# Altium schematic sheet pir_sensor.SchDoc
size A4; SheetNumber: 3; SheetTotal: 3
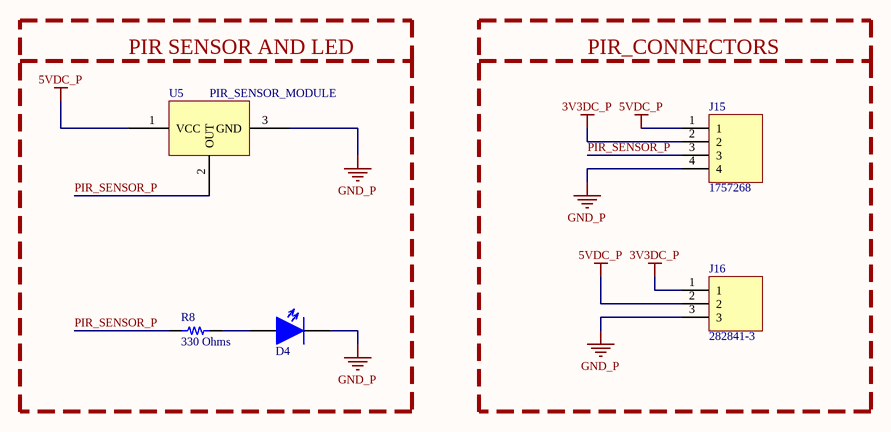
[diagram p0: pir_sensor.SchDoc]

## Parts
D4  LTST-C171GKT  [LED_GREEN_0805]  (value not drawn)
J15  1757268  [CONNECTOR_4Pin]
J16  282841-3  [CONNECTOR_3Pin]
R8  330 Ohms  [RES 0805_2012]
U5  PIR_SENSOR_MODULE  [PIR_SENSOR_MODULE]

## Nets
3V3DC_P: J15.2 J16.1
5VDC_P: J15.1 J16.2 U5.1(VCC)
GND_P: D4.1 J15.4 J16.3 U5.3(GND)
PIR_SENSOR_P: J15.3 R8.1 U5.2(OUT)
NetD4_2: D4.2 R8.2

## Notes on the sheet
- PIR SENSOR AND LED
- PIR_CONNECTORS

## Library data of the parts
D4 = LED GREEN 0805: Green 569nm LED Indication - Discrete 2.1V 0805 (2012 Metric); Manufacturer: Vishay Lite-On; Designed by: EMRE; Lens Color: Colorless; Viewing Angle: 130°; Lens Style: Diffused,Colorless,Rectangular,Clear; Luminous Intensity: 12mcd; Forward Current: 30mA; Power Rating: 100mW; Test Current: 10mA; Lens Transparency: Clear; Number of Elements: 1; Wavelength: 585nm; Reverse Voltage: 5V; Supplier 1: Digi-Key; Manufacturer Part Number: LTST-C171GKT; RoHS: Yes; Category: LEDs; Stock 1: 498344; Pricing 1: 1=0,26000, 10=0,14100, 100=0,06560, 500=0,06060, 1000=0,04747 (USD); Mount: Surface Mount; Case/Package: 0805; Number of Pins: 2; Color: Green; Case Code (Metric): 2012; Case Code (Imperial): 0805; Min Operating Temperature: -55°C; Max Operating Temperature: 85°C; Package Quantity: 1; Packaging: Tape and Reel; Forward Voltage: 2.1V; Illumination Color: Green; Dominant Wavelength: 569nm; Power Dissipation: 100mW; Number of LEDs: 1; Series: CHIPLED 0805; Length: 2mm; Width: 1.25mm; Height: 0.8mm; Depth: 1.25mm; Radiation Hardening: No; Lead Free: Lead Free; RoHS Compliant: Yes; ComponentLink1URL: https://datasheet.ciiva.com/2110/ltst-c171gkt-2110000.pdf?src-supplier=Digi-Key; ComponentLink1Description: https://datasheet.ciiva.com/2110/ltst-c171gkt-2110000.pdf?src-supplier=Digi-Key; ComponentLink2URL: https://datasheet.ciiva.com/11773/0900766b80dc0296-11773991.pdf?src-supplier=RSComponents; ComponentLink2Description: https://datasheet.ciiva.com/11773/0900766b80dc0296-11773991.pdf?src-supplier=RSComponents; ComponentLink3URL: https://datasheet.ciiva.com/12400/lite-on-ltst-c171gkt-190133-12400647.pdf?src-supplier=Mouser; ComponentLink3Description: https://datasheet.ciiva.com/12400/lite-on-ltst-c171gkt-190133-12400647.pdf?src-supplier=Mouser; ComponentLink4URL: https://datasheet.ciiva.com/2110/ltst-c171gkt-2110001.pdf?src-supplier=Digi-Key; ComponentLink4Description: https://datasheet.ciiva.com/2110/ltst-c171gkt-2110001.pdf?src-supplier=Digi-Key; ComponentLink5URL: https://datasheet.ciiva.com/2110/ltst-c171gkt-2110002.pdf?src-supplier=Digi-Key; ComponentLink5Description: https://datasheet.ciiva.com/2110/ltst-c171gkt-2110002.pdf?src-supplier=Digi-Key; ComponentLink6URL: https://datasheet.ciiva.com/16396/ltst-c171gkt-16396549.pdf?src-supplier=Future+Electronics; ComponentLink6Description: https://datasheet.ciiva.com/16396/ltst-c171gkt-16396549.pdf?src-supplier=Future+Electronics; Supplier Part Number 1: 160-1423-1-ND
J15 = CONNECTOR_4Pin: Terminal Header; 12 A; 5.08 mm; 4; Solder Mount; 1.4 mm; 4 kV; 250 V; PBT; Manufacturer: Phoenix Contact; Max Current Rating: 12A; Voltage Rating: 250V; Number of Positions Per Level: 4; Number of Levels: 1; Current: 15A; Voltage: 300V; Gender: Male; Connector Type: Plug; Pitch: 5.08mm; Approvals: UL,CSA; Supplier 1: Digi-Key; Manufacturer Part Number: 1757268; RoHS: Yes; Category: Terminal Blocks; Stock 1: 17192; Pricing 1: 1=1,62, 10=1,484, 50=1,419, 100=1,3803, 250=1,29, 500=1,1868, 1000=1,0965, 2500=1,0449, 5000=0,9804 (USD); Mount: Through Hole; Color: Green; Contact Plating: Tin; Weight: 5.396916oz; Housing Color: Green; Housing Material: Polybutylene; Contact Material: Tin; Package Quantity: 50; Packaging: Bulk; Series: MSTBA; Termination: Solder; Number of Rows: 1; Current Rating: 12A; Number of Positions: 4; Number of Contacts: 4; Orientation: Right Angle; Voltage Rating (DC): 250V; Number of Poles: 4; Length: 22.32mm; Width: 22.24mm; Height: 12.1mm; Depth: 12mm; RoHS Compliant: Yes; Reach SVHC Compliant: No; Lead Free: Lead Free; Flammability Rating: UL94 V-0; ComponentLink1URL: https://datasheet.ciiva.com/16096/1757268-16096406.pdf?src-supplier=Onlinecomponents.com; ComponentLink1Description: https://datasheet.ciiva.com/16096/1757268-16096406.pdf?src-supplier=Onlinecomponents.com; ComponentLink2URL: https://datasheet.ciiva.com/15197/getdatasheetpartid-176352-15197330.pdf?src-supplier=Verical; ComponentLink2Description: https://datasheet.ciiva.com/15197/getdatasheetpartid-176352-15197330.pdf?src-supplier=Verical; ComponentLink3URL: https://datasheet.ciiva.com/795/1757268-795434.pdf?src-supplier=Digi-Key; ComponentLink3Description: https://datasheet.ciiva.com/795/1757268-795434.pdf?src-supplier=Digi-Key; ComponentLink4URL: https://datasheet.ciiva.com/7630/1697153-7630841.pdf?src-supplier=Element14; ComponentLink4Description: https://datasheet.ciiva.com/7630/1697153-7630841.pdf?src-supplier=Element14; ComponentLink5URL: https://datasheet.ciiva.com/29210/569323-da-01-en-grundgehaeuse-1757268-250-st-29210575.pdf?src-supplier=Conrad; ComponentLink5Description: https://datasheet.ciiva.com/29210/569323-da-01-en-grundgehaeuse-1757268-250-st-29210575.pdf?src-supplier=Conrad; ComponentLink6URL: https://datasheet.ciiva.com/16703/70054631-16703596.pdf?src-supplier=Allied+Electronics; ComponentLink6Description: https://datasheet.ciiva.com/16703/70054631-16703596.pdf?src-supplier=Allied+Electronics; Supplier Part Number 1: 277-1108-ND
J16 = CONNECTOR_3Pin: Conn Terminal Block 3 POS 5.08mm Solder ST Thru-Hole 17.5A/Contact; Manufacturer: TE Connectivity; Plating: Brass; Number of Levels: 1; Number of Positions Per Level: 3; Current: 17.5A; Voltage: 300V; Closed End: No (Without); Interlock: Yes (With); Connector Type: Receptacle; Wire Gauge (Max): 30AWG; Thread Size: M3; Tail Length: 3.5mm; Supplier 1: Digi-Key; Manufacturer Part Number: 282841-3; RoHS: Yes; Category: Terminal Blocks; Stock 1: 17891; Pricing 1: 1=1,53, 10=1,401, 25=1,3596, 50=1,346, 100=1,2493, 250=1,22864, 500=1,1182, 1000=1,00085, 5000=0,89732 (USD); Mount: Through Hole; Contact Plating: Tin; Housing Color: Green; Contact Material: Brass; Color: Green; Housing Material: Polyamide; Min Operating Temperature: -40°C; Max Operating Temperature: 105°C; Packaging: Carton; Number of Rows: 1; Termination: Solder; Series: Buchanan; Number of Positions: 3; Number of Contacts: 3; Orientation: Straight; Package Quantity: 200; Number of Circuits: 3; Voltage Rating: 300V; Current Rating: 17.5A; Screw Flange: No (Without); Screwless Terminal Block: Yes (With); Side Stackable: No (Without); Max Current Rating: 17.5A; Max Voltage Rating (AC): 300V; Number of Poles: 3; Max Supply Voltage (AC): 300V; Length: 15.24mm; Wire Gauge (Min): 30AWG; Pitch: 5.08mm; Wire/Cable Gauge: 30AWG; Depth: 9mm; Radiation Hardening: No; RoHS Compliant: Yes; Flammability Rating: UL94 V-0; Lead Free: Lead Free; ELV: Compliant; Reach SVHC Compliant: Unknown; ComponentLink1URL: https://datasheet.ciiva.com/26824/getdatasheetpartid-155857-26824002.pdf?src-supplier=Verical; ComponentLink1Description: https://datasheet.ciiva.com/26824/getdatasheetpartid-155857-26824002.pdf?src-supplier=Verical; ComponentLink2URL: https://datasheet.ciiva.com/23766/eng-cd-282841-h6-23766144.pdf?src-supplier=Newark; ComponentLink2Description: https://datasheet.ciiva.com/23766/eng-cd-282841-h6-23766144.pdf?src-supplier=Newark; ComponentLink3URL: https://datasheet.ciiva.com/30238/eng-cs-1308389-eurostyle-terminal-blocks-0607-30238440.pdf?src-supplier=Onlinecomponents.com; ComponentLink3Description: https://datasheet.ciiva.com/30238/eng-cs-1308389-eurostyle-terminal-blocks-0607-30238440.pdf?src-supplier=Onlinecomponents.com; ComponentLink4URL: https://datasheet.ciiva.com/823/eng-cd-282841-h6-823465.pdf?src-supplier=Digi-Key; ComponentLink4Description: https://datasheet.ciiva.com/823/eng-cd-282841-h6-823465.pdf?src-supplier=Digi-Key; Supplier Part Number 1: A98343-ND
R8 = ESR10EZPJ331: RES SMD 330 OHM 5% 0.4W 0805; Manufacturer: Rohm Semiconductor; Power (Watts): 0.4W, 2/5W; Temperature Coefficient: ±200ppm/°C; Part Number: ESR10EZPJ331; Value: 330 Ohms; ComponentLink1Description: Datasheet; ComponentLink1URL: https://www.rohm.com/datasheet/ESR01MZPF/esr-e; ComponentLink2Description: DigiKey Link; ComponentLink2URL: https://www.digikey.com/en/products/detail/rohm-semiconductor/ESR10EZPJ331/1762807; Composition: Thick Film; Device Package: 0805 (2012 Metric); Features: Automotive AEC-Q200, Pulse Withstanding; Height - Seated (Max): 0.026" (0.65mm); LastUpdated: 1.05.2023 19:42:01; Lifecycle Status: Active; Minimum Order: 1; Number of Terminations: 2; Operating Temperature: -55°C ~ 155°C; Package / Case: 0805 (2012 Metric); Packaging: TapeAndReel; PartId: 32307; Part Status: Active; Price: 0.01; Ratings: AEC-Q200; Resistance: 330 Ohms; Series: ESR; Size / Dimension: 0.079" L x 0.049" W (2.00mm x 1.25mm); Supplier 1: DigiKey; Supplier Part Number 1: RHM330KCT-ND; Supplier Device Package: 0805; Tolerance: ±5%